# EAGLE design esp-01 breakout v1_1 (EAGLE 6.3)
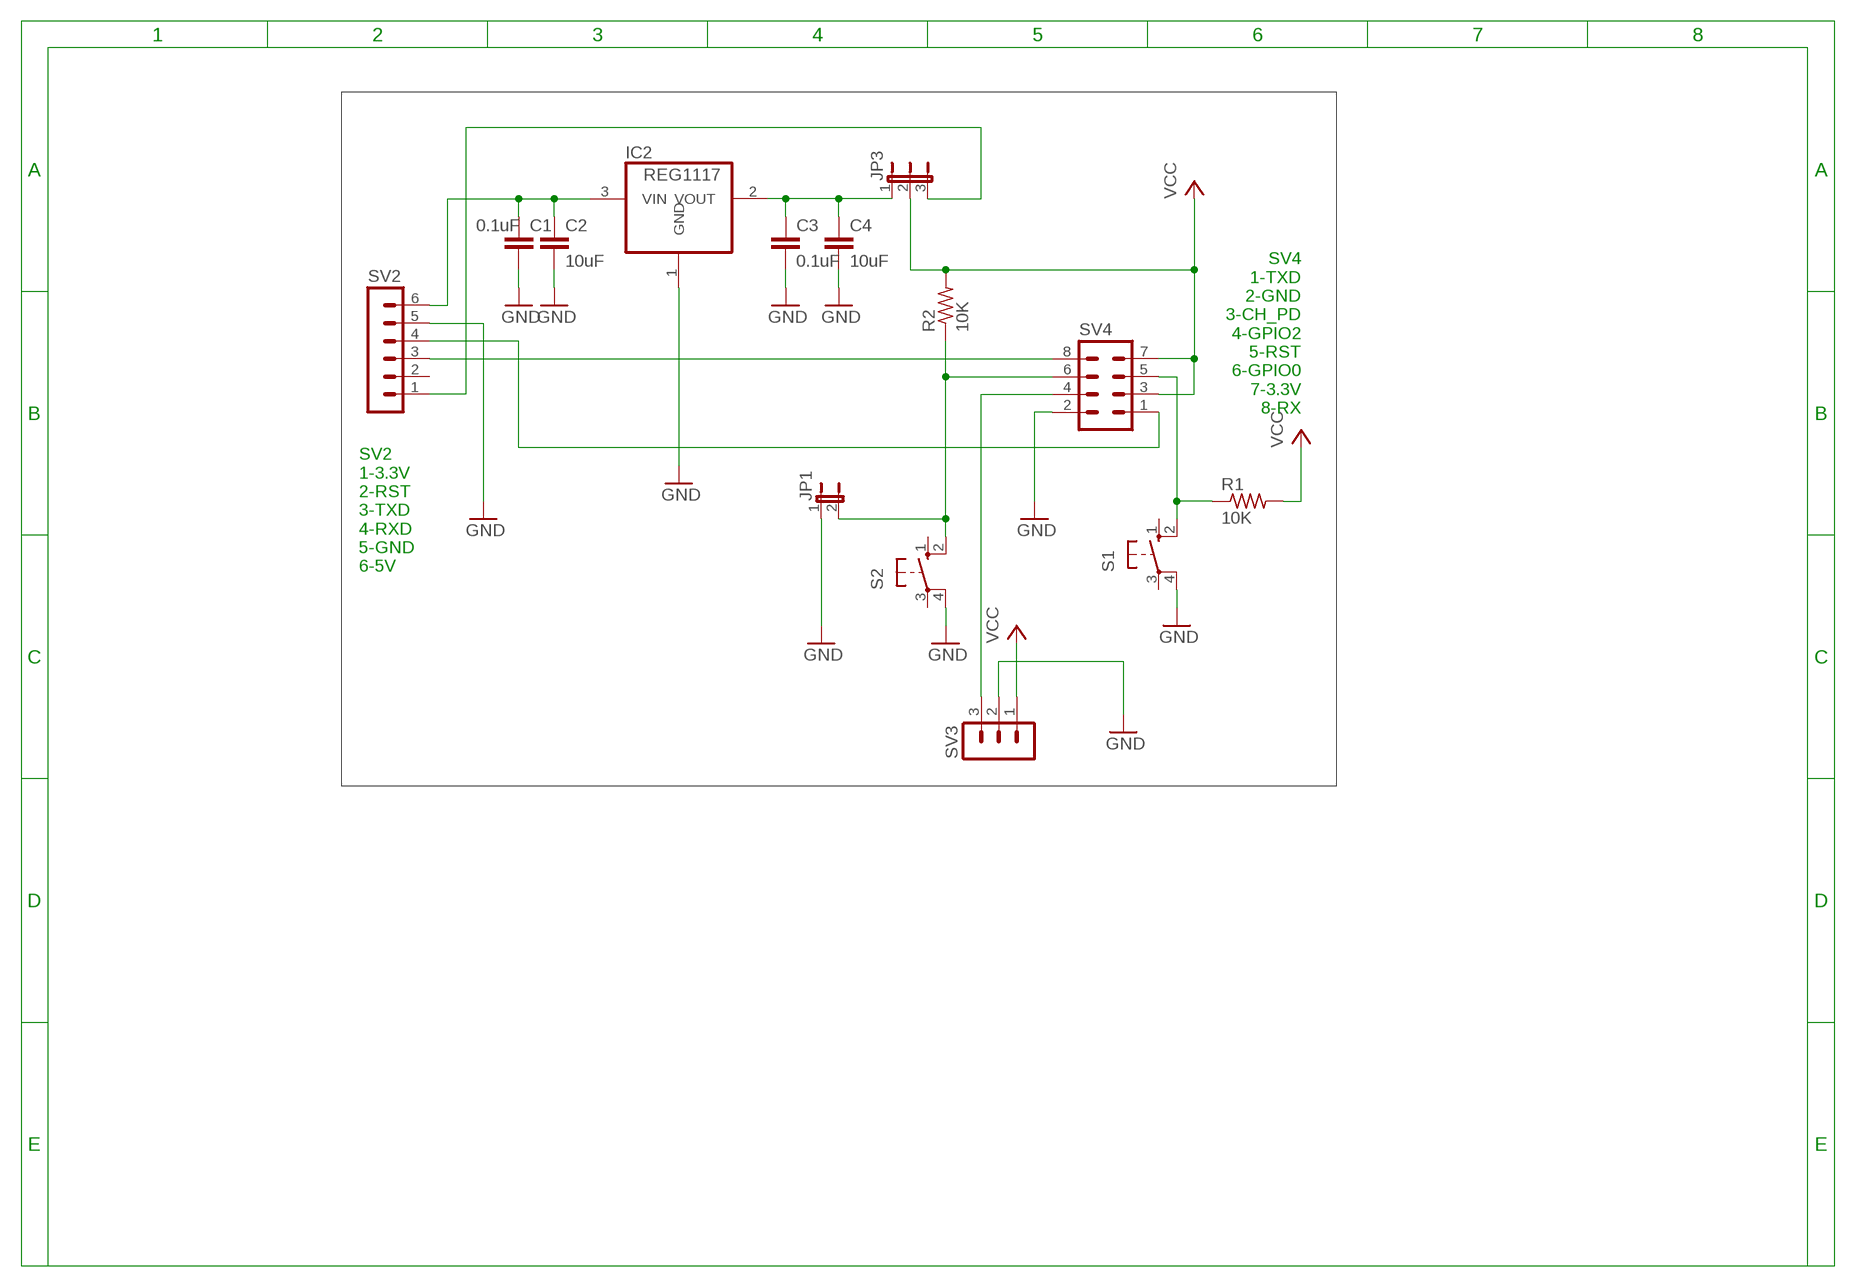
[diagram p0: schematic, sheet 1]

## Parts
C1  0.1uF  C-EU025-025X050  [C025-025X050]
C2  10uF  C-EU025-025X050  [C025-025X050]
C3  0.1uF  C-EU025-025X050  [C025-025X050]
C4  10uF  C-EU025-025X050  [C025-025X050]
IC2  REG1117  [SOT223]
JP1  JP1E  [JP1]
JP3  JP2E  [JP2]
R1  10K  R-US_0207/7  [0207/7]
R2  10K  R-US_0207/7  [0207/7]
S1  10-XX  [B3F-10XX]
S2  10-XX  [B3F-10XX]
SV2  MA06-1  [MA06-1]
SV3  MA03-1  [MA03-1]
SV4  MA04-2  [MA04-2]

## Nets
GND: C1.2 C2.2 C3.2 C4.2 IC2.1(GND) JP1.1 S1.4(P1) S2.4(P1) SV2.5 SV3.2 SV4.2
N$1: C1.1 C2.1 IC2.3(VIN) SV2.6
N$2: C3.1 C4.1 IC2.2(VOUT) JP3.1
N$3: JP3.3 SV2.1
N$4: SV3.3 SV4.4
N$5: R1.1 S1.2(S1) SV4.5
N$6: JP1.2 R2.1 S2.2(S1) SV4.6
N$7: SV2.3 SV4.8
N$8: SV2.4 SV4.1
VCC: JP3.2 R1.2 R2.2 SV3.1 SV4.3 SV4.7
Unconnected: S1.1(S) S1.3(P) S2.1(S) S2.3(P) SV2.2

## Notes on the sheet
- SV4
  1-TXD
  2-GND
  3-CH_PD
  4-GPIO2
  5-RST
  6-GPIO0
  7-3.3V
  8-RX
- SV2
  1-3.3V
  2-RST
  3-TXD
  4-RXD
  5-GND
  6-5V

## Library data of the parts
C1-C4 = resistor:C-EU: CAPACITOR, European symbol
IC2 = burr-brown:REG1117: 800mA and 1A Low Dropout (LDO) Positive Regulator 1.8V, 2.5V, 2.85V, 3.3V, 5V, and Adj; MPN: REG1117; OC_FARNELL: 1097566; OC_NEWARK: 14P6981
JP1 = jumper:JP1E: JUMPER
JP3 = jumper:JP2E: JUMPER
R1 R2 = resistor:R-US_: RESISTOR, American symbol
S1 S2 = switch-omron:10-XX: OMRON SWITCH; MPN: B3F-1000; OC_FARNELL: 176432; OC_NEWARK: 36M3542
SV2 = con-lstb:MA06-1: PIN HEADER; OC_FARNELL: unknown; OC_NEWARK: unknown
SV3 = con-lstb:MA03-1: PIN HEADER; OC_FARNELL: unknown; OC_NEWARK: unknown
SV4 = con-lstb1:MA04-2: PIN HEADER; OC_FARNELL: unknown; OC_NEWARK: unknown

## Board
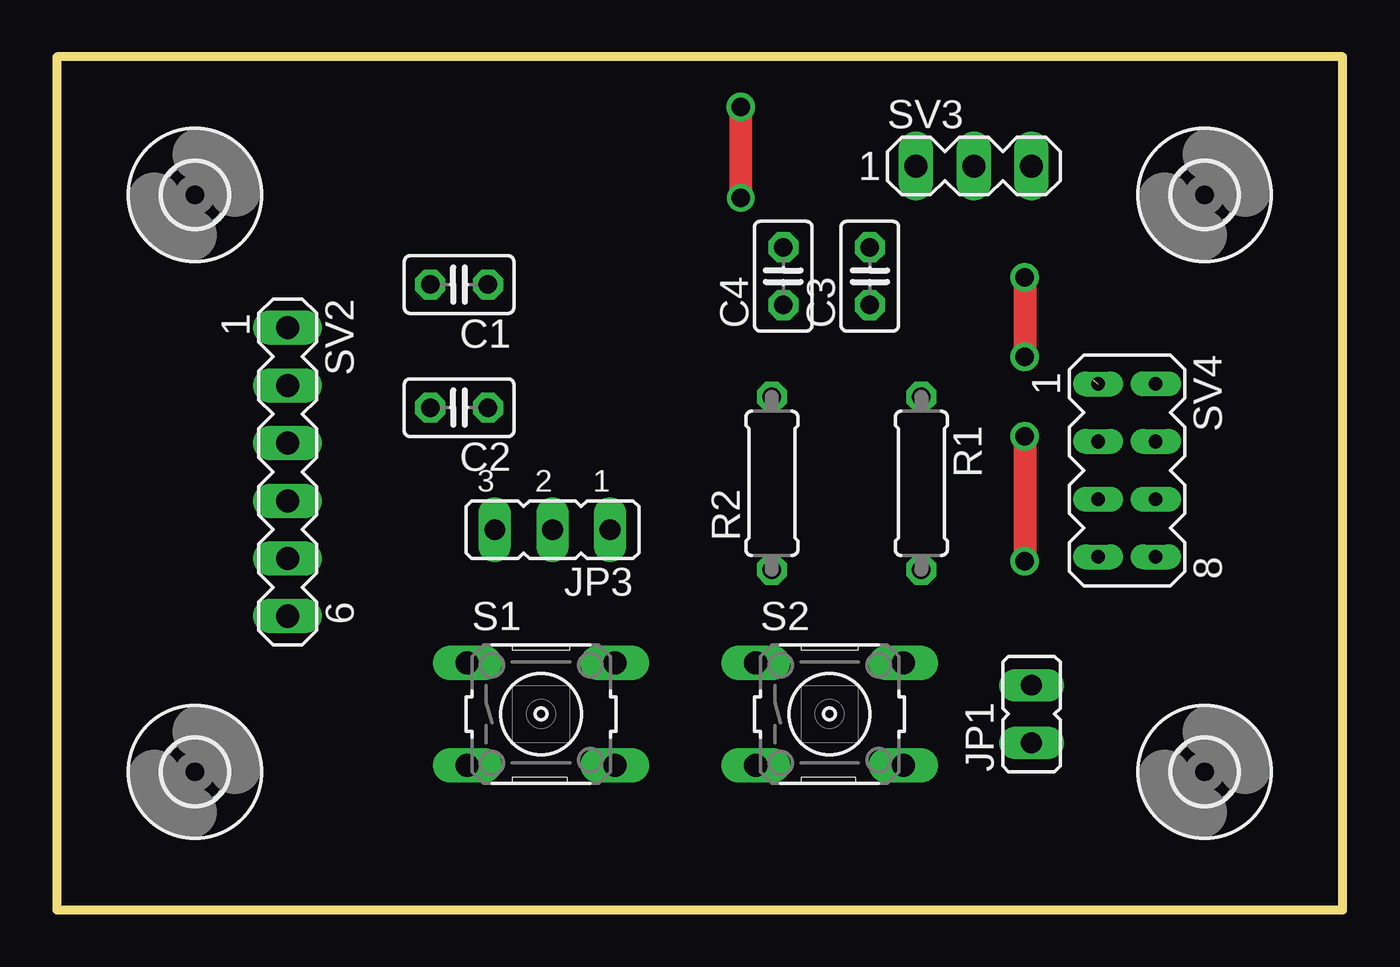
[diagram p1: board, top side]
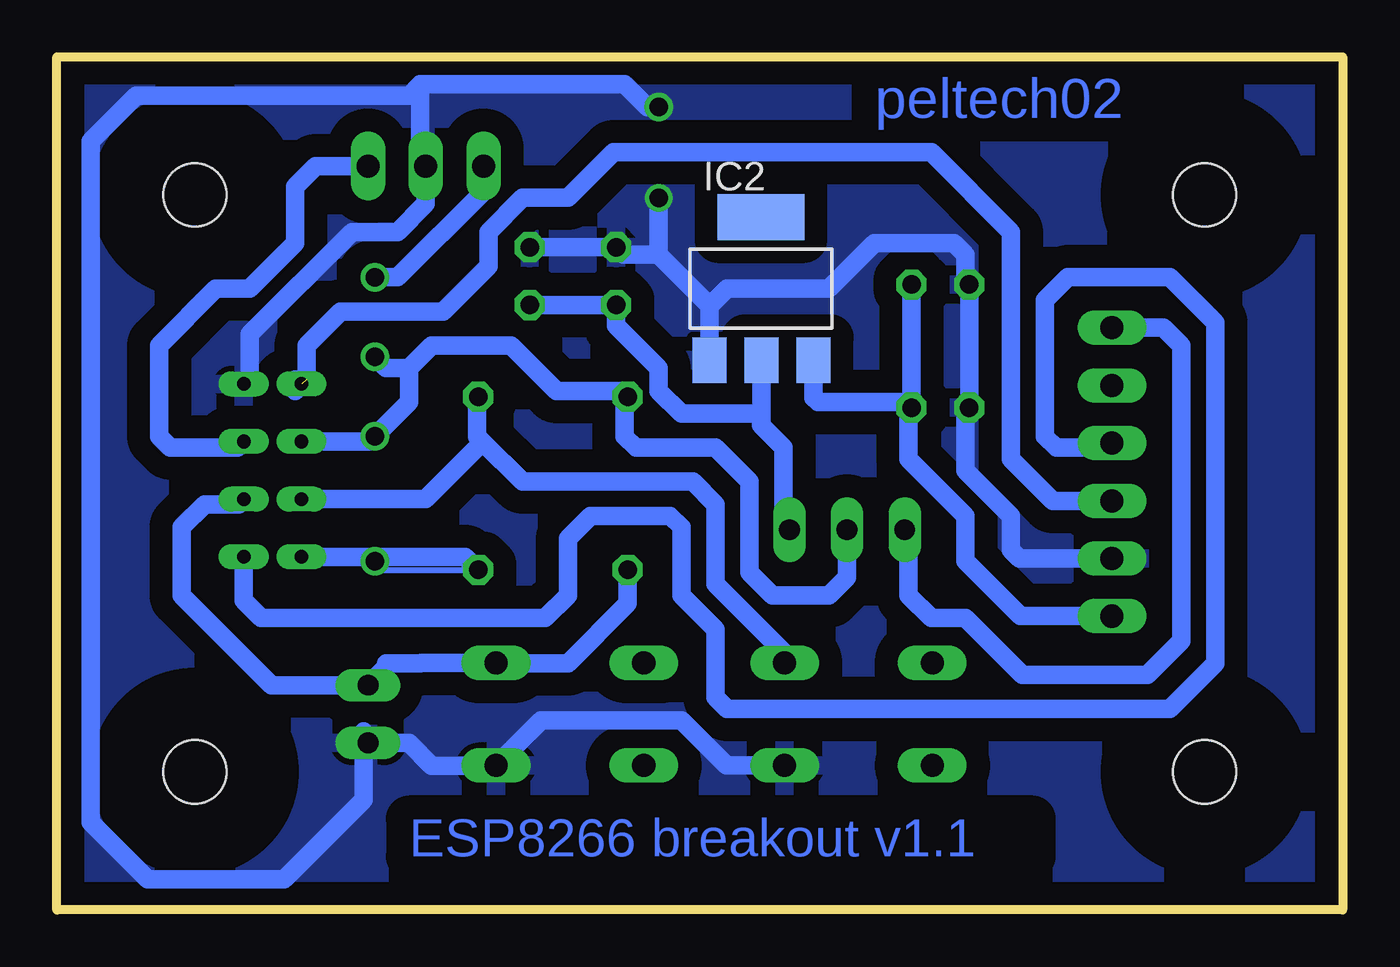
[diagram p2: board, bottom side, seen from below]

Size 56.61 x 37.56 mm. Coordinates in mm from the lower left corner, seen from the top.
Outline: 0,37.56 0,0 56.61,0 56.61,37.56 0,37.56
Copper layers (1*16): Top 0.035mm / dielectric 1.5mm / Bottom 0.035mm
Design rules "default": minimum track width 10mil, minimum drill 24mil, track to track 8mil, track to pad 8mil, pad to pad 8mil, via to via 8mil, smd to smd 8mil, copper to edge 40mil, drill to drill 8mil, minimum pad ring 10mil, minimum via ring 8mil, stop-mask expansion 4mil, vias tented up to drill 0mil, thermal gap 10mil

### Footprints (pad centres in the part's own frame; a part is rotated, then mirrored left to right if it is on the bottom)
C025-025X050 = drill 0.813 octagon: 1 -1.27,0; 2 1.27,0
SOT223 = smd 1.499 x 2.007: 1 -2.261,-3.15; 2 0.025,-3.15; 3 2.311,-3.15 | smd 3.81 x 2.007: 4 0,3.15
JP1 = drill 0.914 long: 1 0,-1.27; 2 0,1.27
JP2 = drill 0.914 long: 1 -2.54,0; 2 0,0; 3 2.54,0
0207/7 = drill 0.813 octagon: 1 -3.81,0; 2 3.81,0
B3F-10XX = drill 1.016 long: 1 -3.251,2.261; 2 3.251,2.261; 3 -3.251,-2.261; 4 3.251,-2.261
MA06-1 = drill 1.016 long: 1 -6.35,0; 2 -3.81,0; 3 -1.27,0; 4 1.27,0; 5 3.81,0; 6 6.35,0
MA03-1 = drill 1.016 long: 1 -2.54,0; 2 0,0; 3 2.54,0
MA04-2 = drill 0.6 pad 1.016 long: 1 -3.81,-1.27; 2 -3.81,1.27; 3 -1.27,-1.27; 4 -1.27,1.27; 5 1.27,-1.27; 6 1.27,1.27; 7 3.81,-1.27; 8 3.81,1.27
2,8 = hole 2.8: 0,0

### Placement (x,y rotation side)
C1  17.71,27.53 180 top
C2  17.71,22.11 180 top
C3  35.79,27.9 90 top
C4  31.98,27.9 90 top
IC2  25.61,27.35 0 bottom
JP1  42.91,8.62 0 top
JP3  21.82,16.74 180 top
R1  38.06,18.78 270 top
R2  31.48,18.78 90 top
S1  21.32,8.62 0 top
S2  34.02,8.62 0 top
SV2  10.16,19.28 270 top
SV3  40.37,32.75 0 top
SV4  47.11,19.35 270 top
U$1  [2,8]  50.53,31.48 0 top
U$2  [2,8]  50.53,6.08 0 top
U$3  [2,8]  6.08,6.08 0 top
U$4  [2,8]  6.08,31.48 0 top

### Tracks (layer width: path | path; a pad name or v marks a point on that pad's centre or on a via)
GND  (via drill 0.8 pad 0.81, 0.8 pad 1.27)
  Top 1.016: v30.11,31.35 v30.11,35.35
  Bottom 0.254: 30.21,35.29 v30.11,35.35 | SV3.2 40.61,32.85 | 27.67,23.86 IC2.1 27.67,23.86
  Bottom 0.813: SV2.5 14.23,15.47 14.61,15.85 14.61,17.35 16.61,19.35 16.61,21.94 C2.2 C1.2 16.61,27.7 16.61,28.85 17.11,29.35 20.61,29.35 22.61,27.35 27.11,27.35 27.87,26.59 | SV3.2 40.37,31.09 41.61,29.85 43.61,29.85 48.11,25.35 48.11,23.43 SV4.2 | S1.4 27.12,6.36 29.11,8.35 35.28,8.35 S2.4 40.11,6.35 41.11,7.35 JP1.1 43.11,7.85 43.11,4.85 46.61,1.35 52.61,1.35 55.11,3.85 55.11,33.85 53.11,35.85 41.11,35.85 40.61,36.35 | IC2.1 27.87,26.59 | 27.87,26.59 27.87,26.61 30.11,28.85 | 30.11,28.85 31.66,28.85 C4.2 C3.2 | v30.11,31.35 30.11,28.85 | v30.11,35.35 30.61,35.35 31.61,36.35 40.61,36.35 | 40.61,32.85 40.61,36.35
  pour Bottom (isolate 1.016): 0.61,37.35 0.61,0.35 56.61,0.35 56.61,37.35
N$1
  Bottom 0.813: SV2.6 14.19,12.93 16.61,15.35 16.61,17.35 19.11,19.85 19.11,21.85 | 19.11,21.85 19.11,21.98 C2.1 | IC2.3 23.3,22.54 23.11,22.35 19.22,22.35 C2.1 | C2.1 18.98,22.22 19.11,22.35 | C1.1 18.98,21.98 19.11,21.85
N$2
  Bottom 0.813: IC2.2 25.59,21.85 | 25.59,21.85 25.59,21.38 25.61,21.35 24.61,20.35 24.61,16.99 JP3.1 | C3.1 C4.1 31.98,25.72 30.11,23.85 30.11,22.85 29.11,21.85 25.59,21.85
N$3
  Bottom 0.813: SV2.1 7.89,25.63 7.11,24.85 7.11,11.85 8.61,10.35 14.11,10.35 16.61,12.85 18.11,12.85 19.11,13.85 19.11,16.57 JP3.3
N$4
  Bottom 0.813: SV3.3 45.21,32.75 46.11,31.85 46.11,29.35 48.11,27.35 49.61,27.35 52.11,24.85 52.11,20.85 51.61,20.35 48.65,20.35 SV4.4
N$5
  Bottom 0.813: S1.2 24.57,11.31 27.61,14.35 27.61,17.85 28.61,18.85 36.11,18.85 37.86,20.6 | 37.86,20.6 38.11,20.85 38.11,22.64 | 38.11,22.85 38.11,22.64 | 38.11,22.64 R1.1 | SV4.5 40.38,18.08 37.86,20.6
N$6
  Bottom 0.813: R2.1 31.48,13.48 34.11,10.85 37.24,10.85 S2.2 40.58,10.88 40.61,10.85 42.11,10.85 42.11,10.69 JP1.2 47.15,9.89 51.11,13.85 51.11,16.85 50.11,17.85 48.61,17.85 SV4.6
N$7
  Bottom 0.813: SV4.8 48.38,13.62 47.61,12.85 35.11,12.85 34.11,13.85 34.11,16.35 33.11,17.35 29.61,17.35 29.11,16.85 29.11,13.85 27.61,12.35 27.61,9.35 27.11,8.85 7.61,8.85 5.61,10.85 5.61,25.85 7.61,27.85 12.11,27.85 13.11,26.85 13.11,20.85 12.61,20.35 10.36,20.35 SV2.3
N$8  (1 unrouted)
  Bottom 0.813: SV2.4 12.77,18.01 14.61,19.85 14.61,29.85 18.11,33.35 32.11,33.35 34.11,31.35 36.11,31.35 37.61,29.85 37.61,28.35 39.61,26.35 44.11,26.35 45.61,24.85 45.61,23.35 46.11,22.85 46.11,23.35
VCC  (via drill 0.8 pad 1.27)
  Top 1.016: v42.61,27.85 v42.61,24.35 | v42.61,20.85 v42.61,15.35
  Bottom 0.254: 37.83,14.97 R1.2 42.91,14.97 v42.61,15.35
  Bottom 0.813: JP3.2 21.82,14.64 22.61,13.85 25.11,13.85 26.11,14.85 26.11,18.85 27.61,20.35 31.11,20.35 31.61,20.85 31.61,22.46 R2.2 31.74,22.85 34.61,22.85 36.61,24.85 40.11,24.85 41.11,23.85 | SV4.3 42.84,20.62 v42.61,20.85 41.11,22.35 41.11,23.85 | SV4.7 38.63,15.54 R1.2 | SV3.1 37.83,31.63 41.61,27.85 v42.61,27.85 | 41.11,23.85 42.11,23.85 v42.61,24.35
(copper drawn outside any net)
  shapes: Bottom area x1

### Text on the board
Bottom: peltech02 | ESP8266 breakout v1.1